# EasyEDA Pro project ProPrj_Microros_esp32_2025-06-17.epro, schematic Schematic_V3.0
Create Date: 2024-04-25; Page Name: P1; Project Name: Microros_esp32; Schematic Name: Schematic_V3.0; Update Date: 2024-10-05; Company: 嘉立创EDA; Page Size: A4; Version: V1.0
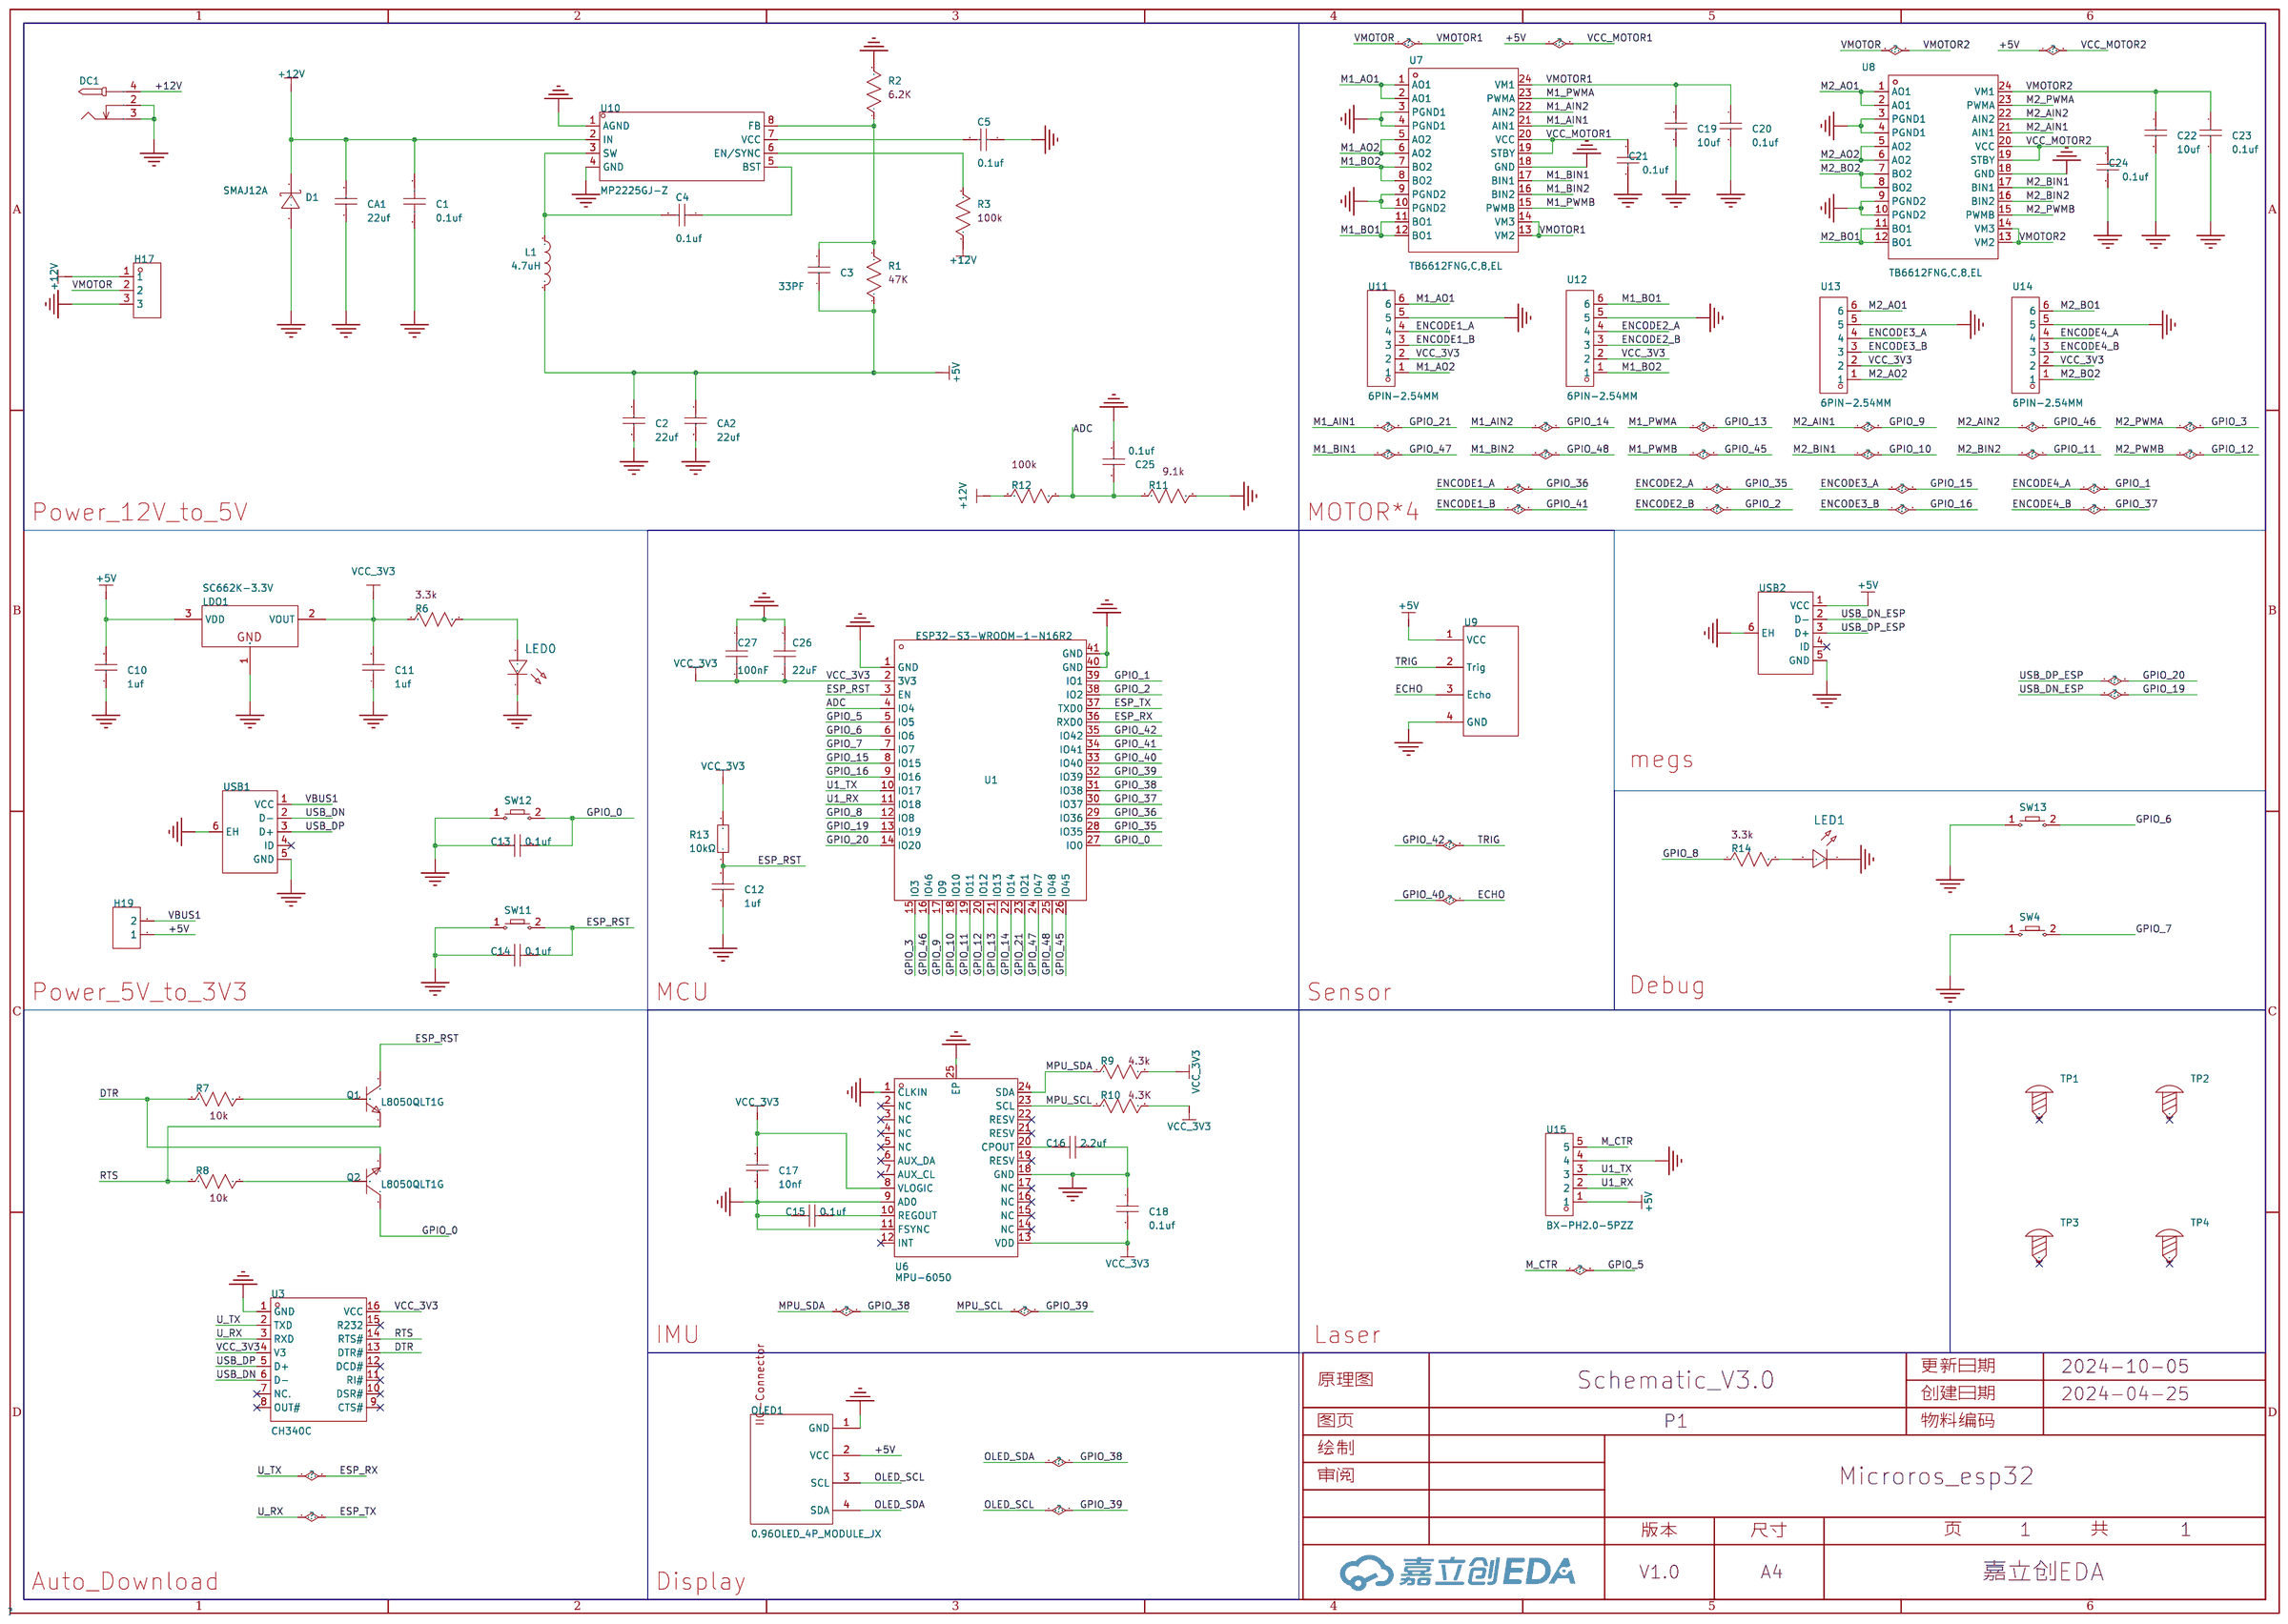
[diagram p3: schematic sheet]

## Parts
C1  0.1uf  [C0603]
C2  22uf  [C1206]
C3  33PF  [C0603]
C4  0.1uf  [C0603]
C5  0.1uf  [C0603]
C10  1uf  [C0603]
C11  1uf  [C0603]
C12  1uf  [C0603]
C13  0.1uf  [C0603]
C14  0.1uf  [C0603]
C15  0.1uf  [C0603]
C16  2.2uf  [C0603]
C17  10nf  [C0603]
C18  0.1uf  [C0603]
C19  10uf  [C0603]
C20  0.1uf  [C0603]
C21  0.1uf  [C0603]
C22  10uf  [C0603]
C23  0.1uf  [C0603]
C24  0.1uf  [C0603]
C25  0.1uf  [C0603]
C26  22uF  [C0603]
C27  100nF  [C0603]
CA1  22uf  [C1206]
CA2  22uf  [C1206]
D1  SMAJ12A  [SMA_L4.3-W2.8-LS5.1-RD]
DC1  -  [DC-2.0]
H17  -  [HDR-TH_3P-P2.54-V-F]
H19  -  [HDR-TH_2P-P2.54-V-F]
L1  4.7uH  [IND-SMD_L6.5-W6.0_GPSR0630]
LDO1  SC662K-3.3V  [SOT-23-3_L2.9-W1.3-P1.90-LS2.4-BR]
LED0  -  [LED_0603]
LED1  -  [LED_0603]
OLED1  0.96OLED_4P_MODULE_JX  [0.96OLED_4P]
Q1  L8050QLT1G  [SOT-23-3_L2.9-W1.3-P1.90-LS2.4-BR]
Q2  L8050QLT1G  [SOT-23-3_L2.9-W1.3-P1.90-LS2.4-BR]
R1  -  [R0603]
R2  -  [R0603]
R3  -  [R0603]
R6  -  [R0603]
R7  -  [R0603]
R8  -  [R0603]
R9  -  [R0603]
R10  -  [R0603]
R11  -  [R0603]
R12  -  [R0603]
R13  10kΩ  [R0603]
R14  -  [R0603]
SW4  -  [Key_SMD_3.6x6.1x2.5]
SW11  -  [Key_SMD_3.6x6.1x2.5]
SW12  -  [Key_SMD_3.6x6.1x2.5]
SW13  -  [Key_SMD_3.6x6.1x2.5]
TP1  -  [M3螺丝]
TP2  -  [M3螺丝]
TP3  -  [M3螺丝]
TP4  -  [M3螺丝]
U1  ESP32-S3-WROOM-1-N16R2  [WIRELM-SMD_ESP32-S3-WROOM-1]
U3  CH340C  [SOP-16_L10.0-W3.9-P1.27-LS6.0-BL]
U6  MPU-6050  [QFN-24_L4.0-W4.0-P0.50-BL-EP2.7]
U7  TB6612FNG,C,8,EL  [SSOP-24_L8.3-W5.6-P0.65-LS7.6-BL]
U8  TB6612FNG,C,8,EL  [SSOP-24_L8.3-W5.6-P0.65-LS7.6-BL]
U9  -  [HC-SR04]
U10  MP2225GJ-Z  [TSOT-23-8_L2.9-W1.6-P0.65-LS2.8-BR]
U11  6PIN-2.54MM  [CONN-TH_XH2.54-6P]
U12  6PIN-2.54MM  [CONN-TH_XH2.54-6P]
U13  6PIN-2.54MM  [CONN-TH_XH2.54-6P]
U14  6PIN-2.54MM  [CONN-TH_XH2.54-6P]
U15  BX-PH2.0-5PZZ  [CONN-TH_5P-P2.00_BX-PH2.0-5PZZ]
USB1  -  [USB_Micro]
USB2  -  [USB_Micro]

## Library data of the parts
C1 = CAP_0603: Supplier Footprint: 0603
C2-C5 C10-C25 CA1 CA2 = 1206B102K202NT: 容值:1nF;精度:±10%;额定电压:2kV;材质(温度系数):X7R;; LCSC Part Name: 1nF ±10% 2kV; Supplier Part: C9196; Manufacturer: FH(风华); Supplier Footprint: 1206; JLCPCB Part Class: 基础库; Datasheet: https://atta.szlcsc.com/upload/public/pdf/source/20200305/C486355_26A10D38EF8C2A5C37091D0039909270.pdf; Supplier: LCSC; Tolerance: ±10%; Voltage Rated: 2kV; Temperature Coefficient: X7R
C26 = CL10A226MQ8NRNC: 容值:22uF;精度:±20%;额定电压:6.3V;材质(温度系数):X5R;; LCSC Part Name: 22uF ±20% 6.3V; Supplier Part: C59461; Manufacturer: SAMSUNG(三星); Supplier Footprint: 0603; JLCPCB Part Class: 基础库; Datasheet: https://atta.szlcsc.com/upload/public/pdf/source/20160218/1457707763339.pdf; Supplier: LCSC; Tolerance: ±20%; Voltage Rated: 6.3V; Temperature Coefficient: X5R
C27 = CC0603KRX7R9BB104: 容值:100nF;精度:±10%;额定电压:50V;材质(温度系数):X7R;; LCSC Part Name: 100nF ±10% 50V; Supplier Part: C14663; Manufacturer: YAGEO(国巨); Supplier Footprint: 0603; JLCPCB Part Class: 基础库; Datasheet: https://atta.szlcsc.com/upload/public/pdf/source/20180910/C282072_33301C7F631E79921B82A8DAC6BCC5B3.pdf; Supplier: LCSC; Tolerance: ±10%; Voltage Rated: 50V; Temperature Coefficient: X7R
D1 = SMAJ12A: 反向截止电压(Vrwm):12V;最大钳位电压:19.9V;峰值脉冲电流(Ipp)@10/1000us:20.1A;击穿电压:13.3V;; LCSC Part Name: 单向TVS 12V截止 20.1A峰值脉冲; Supplier Part: C356741; Manufacturer: JJW(捷捷微); Supplier Footprint: SMA(DO-214AC); JLCPCB Part Class: 扩展库; Datasheet: https://atta.szlcsc.com/upload/public/pdf/source/20190118/C364660_B64EB57815AD6306F3CC88F8ECD7A3CF.pdf; Supplier: LCSC; Reverse Stand-Off Voltage (Vrwm): 12V; Maximum Clamping Voltage: 19.9V; Peak Pulse Current (Ipp)@10/1000us: 20.1A; Breakdown Voltage: 13.3V; Type: TVS
DC1 = DC-005_2.0: Supplier Footprint: 插件
H17 = HDR-F_2.54_1x3P: Supplier Part: C541850; Supplier Footprint: 插件
H19 = HDR-F_2.54_1x2P: Supplier Part: C49661; Supplier Footprint: 插件
L1 = GPSR0630-3R3M: 电感值:3.3uH;精度:±20%;额定电流:5A;; LCSC Part Name: 3.3uH ±20%; Supplier Part: C477238; Manufacturer: Gantong(感通); Supplier Footprint: SMD; JLCPCB Part Class: 扩展库; Datasheet: https://atta.szlcsc.com/upload/public/pdf/source/20200331/C477236_832C068A9BF5320A61F8C7EAA1B09F78.pdf; Supplier: LCSC; Tolerance: ±20%; Rated Current: 5A; DC Resistance (DCR): 32mΩ
LDO1 = SC662K-3.3V: 输出类型:固定;最大输入电压:6V;输出电压:3.3V;最大输出电流:250mA;电源纹波抑制比(PSRR):50dB@(1kHz);输出极性:正极;; LCSC Part Name: 输入6V 输出3.3V 250mA 停产 停产; Supplier Part: C83932; Manufacturer: FM(富满); Supplier Footprint: SOT-23; JLCPCB Part Class: 扩展库; Datasheet: https://atta.szlcsc.com/upload/public/pdf/source/20161024/1477288576049.pdf; Supplier: LCSC; Output Type: 固定; Maximum Input Voltage: 6V; Output Voltage: 3.3V; MAX Output Current: 250mA; Power Supply Rejection Ratio (PSRR): 50dB@(1kHz); Dropout Voltage: 38mV@(10mA); Output Polarity: 正极; Number of Outputs: 1
LED0 LED1 = LED_0603-R: Supplier Footprint: 0603
OLED1 = 0.96OLED_4P_MODULE_JX: Supplier Part: C9900004566; Supplier Footprint: 插件; JLCPCB Part Class: 扩展库; Supplier: LCSC
Q1 Q2 = L8050QLT1G: 晶体管类型:NPN;集电极电流(Ic):800mA;集射极击穿电压(Vceo):25V;功率(Pd):225mW;; LCSC Part Name: 耐压:25V 电流:800mA NPN; Supplier Part: C49581; Manufacturer: LRC(乐山无线电); Supplier Footprint: SOT-23; JLCPCB Part Class: 扩展库; Datasheet: https://atta.szlcsc.com/upload/public/pdf/source/20150518/1457707314424.pdf; Supplier: LCSC; Transistor Type: NPN; Collector Current (Ic): 800mA; Collector-Emitter Breakdown Voltage (Vceo): 25V; Power Dissipation (Pd): 225mW
R1 = R_0603_US: Value(Ω): 47K
R2 = R_0603_US: Value(Ω): 6.2K
R3 R12 = R_0603_US: Value(Ω): 100k
R6 R14 = R_0603_US: Value(Ω): 3.3k
R7 R8 = R_0603_US: Value(Ω): 10k
R9 = R_0603_US: Value(Ω): 4.3k
R10 = R_0603_US: Value(Ω): 4.3K
R11 = R_0603_US: Value(Ω): 9.1k
R13 = 0603WAF1002T5E: 电阻类型:厚膜电阻;阻值:10kΩ;精度:±1%;功率:100mW;最大工作电压:75V;温度系数:±100ppm/℃;; LCSC Part Name: 厚膜电阻 10kΩ ±1% 100mW; Supplier Part: C25804; Manufacturer: UNI-ROYAL(厚声); Supplier Footprint: 0603; JLCPCB Part Class: 基础库; Datasheet: https://atta.szlcsc.com/upload/public/pdf/source/20200306/C422600_1E6D84923E4A46A82E41ADD87F860B5C.pdf; Supplier: LCSC; Type: 厚膜电阻; Tolerance: ±1%; Power(Watts): 100mW; Overload Voltage (Max): 75V; Temperature Coefficient: ±100ppm/℃; Operating Temperature Range: -55℃~+155℃
SW4 SW11-SW13 = Key_SMD_3.6x6.1x2.5: Supplier Footprint: SMD
TP1-TP4 = M3螺丝: Supplier Footprint: 插件
U1 = ESP32-S3-WROOM-1-N16R2: LCSC Part Name: 通用型Wi-Fi+低功耗蓝牙MCU模组; Supplier Part: C2913205; Manufacturer: ESPRESSIF(乐鑫); Supplier Footprint: SMD,18x25.5mm; JLCPCB Part Class: 扩展库; Datasheet: https://atta.szlcsc.com/upload/public/pdf/source/20220628/A2AC12B3C87735CAEB7EBE2DBE80936C.pdf; Supplier: LCSC
U3 = CH340C: 应用功能:收发器;接口协议:USB 2.0;数据速率:2Mbps;; LCSC Part Name: CH340C USB转串口芯片 CH340; Supplier Part: C84681; Manufacturer: WCH(南京沁恒); Supplier Footprint: SOP-16; JLCPCB Part Class: 扩展库; Datasheet: https://atta.szlcsc.com/upload/public/pdf/source/20200819/C84681_ADBED554CE321879DBD6B1D06488689C.pdf; Supplier: LCSC; Applications Function: 收发器; Protocol: USB 2.0; Supply Voltage: 3.3V；5V; Data Rate: 2Mbps
U6 = MPU-6050: 传感器类型:加速度计陀螺仪;; Supplier Part: C24112; Manufacturer: TDK InvenSense(应美盛); Supplier Footprint: QFN-24-EP(4x4); JLCPCB Part Class: 扩展库; Datasheet: https://atta.szlcsc.com/upload/public/pdf/source/20140425/1457707046159.pdf; Supplier: LCSC; Sensor Type: 加速度计陀螺仪; Operating Temperature: -40℃~+85℃
U7 U8 = TB6612FNG,C,8,EL: 驱动电机类型:有刷直流电机;电源电压:2.7V~5.5V;输出电流:1A;接口:并行;; LCSC Part Name: 1A 有刷直流电机驱动芯片 5.5V; Supplier Part: C141517; Manufacturer: TOSHIBA(东芝); Supplier Footprint: SSOP-24; JLCPCB Part Class: 扩展库; Datasheet: https://atta.szlcsc.com/upload/public/pdf/source/20171128/C141517_15118625624231147036.pdf; Supplier: LCSC; Drive motor type: 有刷直流电机; Supply Voltage: 2.7V~5.5V; Output Current: 1A; Interface: 并行; Operating Temperature: -20℃~+85℃@(Ta)
U9 = HC-SR04
U10 = MP2225GJ-Z_C133066: 功能类型:降压型;输出类型:可调;输入电压:4.5V~18V;输出电压:600mV~17V;输出电流(最大值):5A;; Supplier Part: C133066; Manufacturer: MPS; Supplier Footprint: TSOT-23-8; JLCPCB Part Class: 扩展库; Datasheet: https://atta.szlcsc.com/upload/public/pdf/source/20240315/DE01001F1E5BE5D21C887012CE3070B7.pdf; Supplier: LCSC; Function: 降压型; Output Type: 可调; Input Voltage: 4.5V~18V; Output Voltage: 600mV~17V; Output Current (Max): 5A; Switching Frequency: 500kHz; Operating Temperature: -40℃~+125℃@(TJ); Synchronous Rectification: 是; Number of Outputs: 1; Topology: 降压式; Switch tube (built-in/external): 内置
U11-U14 = 6PIN-2.54MM: Supplier Part: C9900021155; Supplier Footprint: CONN-TH-6P; JLCPCB Part Class: 扩展库; Supplier: LCSC
U15 = BX-PH2.0-5PZZ: 插针结构:1x5P;间距:2mm;安装方式:直插;参考系列:PH;总PIN数:5P;排数:1;每排PIN数:5;行距:-;额定电流:2A;触头材质:黄铜;触头镀层:锡;工作温度范围:-25℃~+85℃;; Supplier Part: C18077747; Manufacturer: Bossie(博锡); Supplier Footprint: 插件,P=2mm; Datasheet: https://atta.szlcsc.com/upload/public/pdf/source/20231017/DA89917E5E668936C9CB0CC4B4543945.pdf; Supplier: LCSC; Pins Structure: 1x5P; Pitch: 2mm; Mounting Style: 直插; Reference Series: PH; Number of Pins: 5P; Number of Rows: 1; Number of PINs Per Row: 5; Current Rating (Max): 2A; Contact Material: 黄铜; Contact Plating: 锡; Operating Temperature Range: -25℃~+85℃
USB1 USB2 = USB_Micro-B: Supplier Footprint: SMD

## Nets
+5V: C2.2 C3.1 C10.1 C21.1 C24.1 CA2.1 H19.1 L1.2 LDO1.3(VDD) OLED1.2(VCC) R1.1 U7.19(STBY) U7.20(VCC) U8.19(STBY) U8.20(VCC) U9.1(VCC) U15.1 USB2.1(VCC)
+12V: C1.2 CA1.2 D1.1(K) DC1.4 H17.1 R3.1 R12.2 U10.2(IN)
GND: C1.1 C2.1 C5.1 C10.2 C11.1 C12.2 C13.2 C14.2 C15.2 C16.1 C17.1 C18.1 C19.2 C20.2 C21.2 C22.2 C23.2 C24.2 C25.1 C26.2 C27.1 CA1.1 CA2.2 D1.2(A) DC1.2 DC1.3 H17.3 LDO1.1(GND) LED0.1(C) LED1.1(C) OLED1.1(GND) R2.2 R11.1 SW4.1 SW11.1 SW12.1 SW13.1 U1.1(GND) U1.40(GND) U1.41(GND) U3.1(GND) U6.1(CLKIN) U6.9(AD0) U6.11(FSYNC) U6.18(GND) U6.25(EP) U7.3(PGND1) U7.4(PGND1) U7.9(PGND2) U7.10(PGND2) U7.18(GND) U8.3(PGND1) U8.4(PGND1) U8.9(PGND2) U8.10(PGND2) U8.18(GND) U9.4(GND) U10.1(AGND) U10.4(GND) U11.5 U12.5 U13.5 U14.5 U15.4 USB1.5(GND) USB1.6(EH) USB2.5(GND) USB2.6(EH)
VBUS1: H19.2 USB1.1(VCC)
VCC_3V3: C11.2 C17.2 C18.2 C26.1 C27.2 LDO1.2(VOUT) R6.1 R9.2 R10.2 R13.2 U1.2(3V3) U3.4(V3) U3.16(VCC) U6.8(VLOGIC) U6.13(VDD) U11.2 U12.2 U13.2 U14.2
ADC: C25.2 R11.2 R12.1 U1.4(IO4)
DTR: Q2.2(E) R7.1 U3.13(DTR#)
ECHO: U1.33(IO40) U9.3(Echo)
ENCODE1_A: U1.29(IO36) U11.4
ENCODE1_B: U1.34(IO41) U11.3
ENCODE2_A: U1.28(IO35) U12.4
ENCODE2_B: U1.38(IO2) U12.3
ENCODE3_A: U1.8(IO15) U13.4
ENCODE3_B: U1.9(IO16) U13.3
ENCODE4_A: U1.39(IO1) U14.4
ENCODE4_B: U1.30(IO37) U14.3
ESP_RST: C12.1 C14.1 Q1.3(C) R13.1 SW11.2 U1.3(EN)
ESP_RX: U1.36(RXD0) U3.2(TXD)
ESP_TX: U1.37(TXD0) U3.3(RXD)
GPIO_0: C13.1 Q2.3(C) SW12.2 U1.27(IO0)
GPIO_3: U1.15(IO3) U8.23(PWMA)
GPIO_5: U1.5(IO5) U15.5
GPIO_6: SW13.2 U1.6(IO6)
GPIO_7: SW4.2 U1.7(IO7)
GPIO_8: R14.1 U1.12(IO8)
GPIO_9: U1.17(IO9) U8.21(AIN1)
GPIO_10: U1.18(IO10) U8.17(BIN1)
GPIO_11: U1.19(IO11) U8.16(BIN2)
GPIO_12: U1.20(IO12) U8.15(PWMB)
GPIO_13: U1.21(IO13) U7.23(PWMA)
GPIO_14: U1.22(IO14) U7.22(AIN2)
GPIO_19: U1.13(IO19) USB2.2(D-)
GPIO_20: U1.14(IO20) USB2.3(D+)
GPIO_21: U1.23(IO21) U7.21(AIN1)
GPIO_38: OLED1.4(SDA) R9.1 U1.31(IO38) U6.24(SDA)
GPIO_39: OLED1.3(SCL) R10.1 U1.32(IO39) U6.23(SCL)
GPIO_42: U1.35(IO42) U9.2(Trig)
GPIO_45: U1.26(IO45) U7.15(PWMB)
GPIO_46: U1.16(IO46) U8.22(AIN2)
GPIO_47: U1.24(IO47) U7.17(BIN1)
GPIO_48: U1.25(IO48) U7.16(BIN2)
M1_AO1: U7.1(AO1) U7.2(AO1) U11.6
M1_AO2: U7.5(AO2) U7.6(AO2) U11.1
M1_BO1: U7.11(BO1) U7.12(BO1) U12.6
M1_BO2: U7.7(BO2) U7.8(BO2) U12.1
M2_AO1: U8.1(AO1) U8.2(AO1) U13.6
M2_AO2: U8.5(AO2) U8.6(AO2) U13.1
M2_BO1: U8.11(BO1) U8.12(BO1) U14.6
M2_BO2: U8.7(BO2) U8.8(BO2) U14.1
RTS: Q1.2(E) R8.1 U3.14(RTS#)
U1_RX: U1.11(IO18) U15.2
U1_TX: U1.10(IO17) U15.3
USB_DN: U3.6(D-) USB1.2(D-)
USB_DP: U3.5(D+) USB1.3(D+)
VMOTOR: C19.1 C20.1 C22.1 C23.1 H17.2 U7.13(VM2) U7.14(VM3) U7.24(VM1) U8.13(VM2) U8.14(VM3) U8.24(VM1)
$1N8417: LED0.2(A) R6.2
$1N8423: Q1.1(B) R7.2
$1N8428: Q2.1(B) R8.2
$1N8498: C15.1 U6.10(REGOUT)
$1N8500: C16.2 U6.20(CPOUT)
$1N8840: C5.2 U10.7(VCC)
$1N8848: R3.2 U10.6(EN/SYNC)
$1N8850: C4.2 L1.1 U10.3(SW)
$1N8851: C4.1 U10.5(BST)
$1N8854: C3.2 R1.2 R2.1 U10.8(FB)
$1N21655: LED1.2(A) R14.2

Not connected (* = marked no-connect by the designer): TP1 1*; TP2 1*; TP3 1*; TP4 1*; U3 7(NC.)* 8(OUT#)* 9(CTS#)* 10(DSR#)* 11(RI#)* 12(DCD#)* 15(R232)*; U6 2(NC)* 3(NC)* 4(NC)* 5(NC)* 6(AUX_DA)* 7(AUX_CL)* 12(INT)* 14(NC)* 15(NC)* 16(NC)* 17(NC)* 19(RESV)* 21(RESV)* 22(RESV)*; USB1 4(ID)*; USB2 4(ID)*

## Notes on the sheet
- Power_12V_to_5V
- MOTOR*4
- megs
- Power_5V_to_3V3
- MCU
- Sensor
- Debug
- IMU
- Laser
- Auto_Download
- Display
